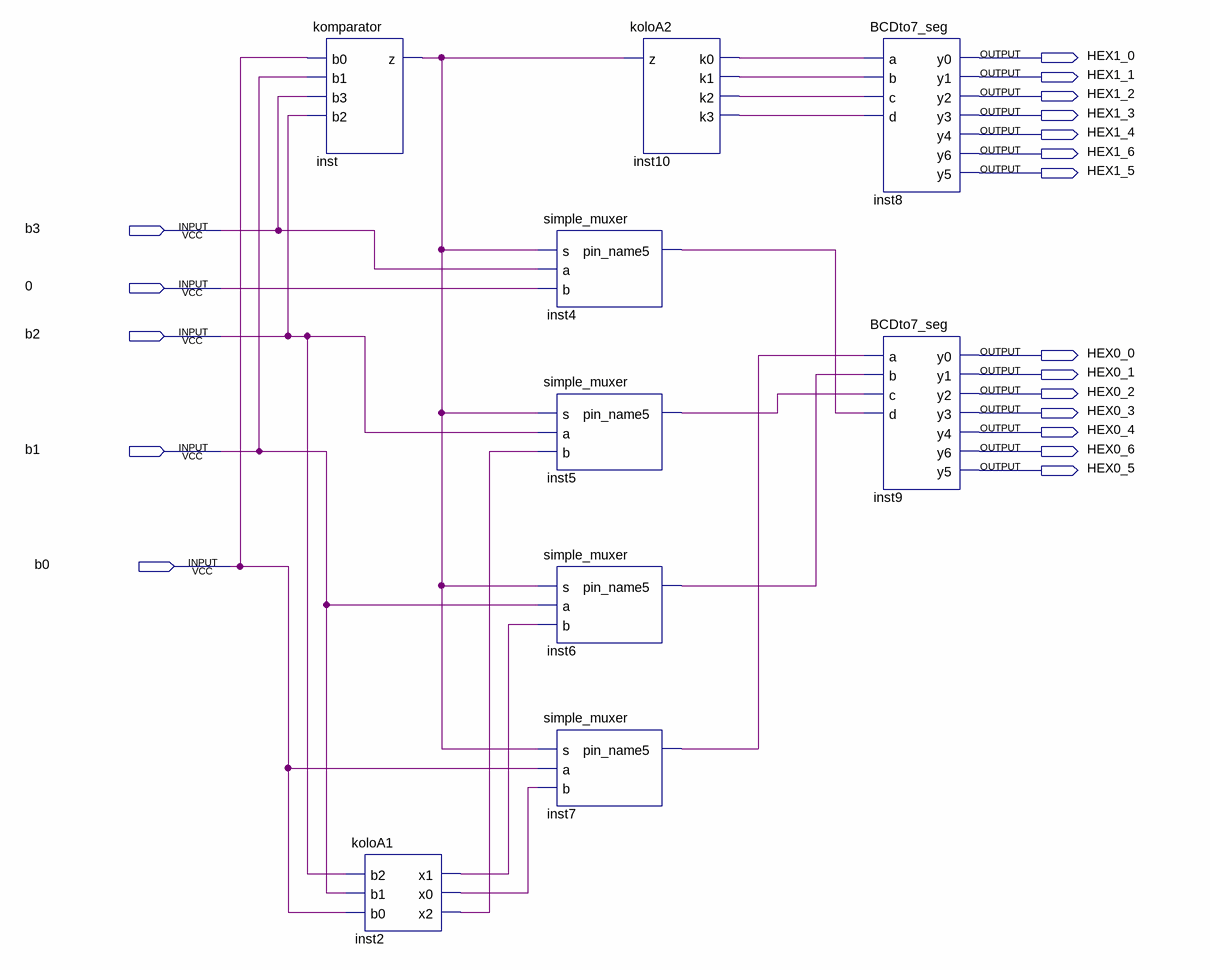
[diagram p0: schematic sheet]
// Quartus schematic bin_to_dec.bdf as structural Verilog: 9 symbols, 19 pins
module bin_to_dec (
  input  b3,
  input  \0 ,
  input  b2,
  input  b1,
  input  b0,
  output HEX1_0,
  output HEX1_1,
  output HEX1_2,
  output HEX1_3,
  output HEX1_4,
  output HEX1_6,
  output HEX1_5,
  output HEX0_0,
  output HEX0_1,
  output HEX0_2,
  output HEX0_3,
  output HEX0_4,
  output HEX0_6,
  output HEX0_5
);

  wire inst2_x0, inst2_x1, inst2_x2, inst4_pin_name5, inst5_pin_name5, inst6_pin_name5, inst7_pin_name5,
       inst10_k0, inst10_k1, inst10_k2, inst10_k3, inst_z;

  komparator inst (.b0(b0), .b1(b1), .b3(b3), .b2(b2), .z(inst_z));
  koloA1 inst2 (.b2(b2), .b1(b1), .b0(b0), .x1(inst2_x1), .x0(inst2_x0), .x2(inst2_x2));
  simple_muxer inst4 (.s(inst_z), .a(b3), .b(\0 ), .pin_name5(inst4_pin_name5));
  simple_muxer inst5 (.s(inst_z), .a(b2), .b(inst2_x2), .pin_name5(inst5_pin_name5));
  simple_muxer inst6 (.s(inst_z), .a(b1), .b(inst2_x1), .pin_name5(inst6_pin_name5));
  simple_muxer inst7 (.s(inst_z), .a(b0), .b(inst2_x0), .pin_name5(inst7_pin_name5));
  koloA2 inst10 (.z(inst_z), .k0(inst10_k0), .k1(inst10_k1), .k2(inst10_k2), .k3(inst10_k3));
  BCDto7_seg inst8 (
    .a(inst10_k0), .b(inst10_k1), .c(inst10_k2), .d(inst10_k3), .y0(HEX1_0), .y1(HEX1_1), .y2(HEX1_2),
    .y3(HEX1_3), .y4(HEX1_4), .y6(HEX1_6), .y5(HEX1_5));
  BCDto7_seg inst9 (
    .a(inst7_pin_name5), .b(inst6_pin_name5), .c(inst5_pin_name5), .d(inst4_pin_name5), .y0(HEX0_0),
    .y1(HEX0_1), .y2(HEX0_2), .y3(HEX0_3), .y4(HEX0_4), .y6(HEX0_6), .y5(HEX0_5));
endmodule
